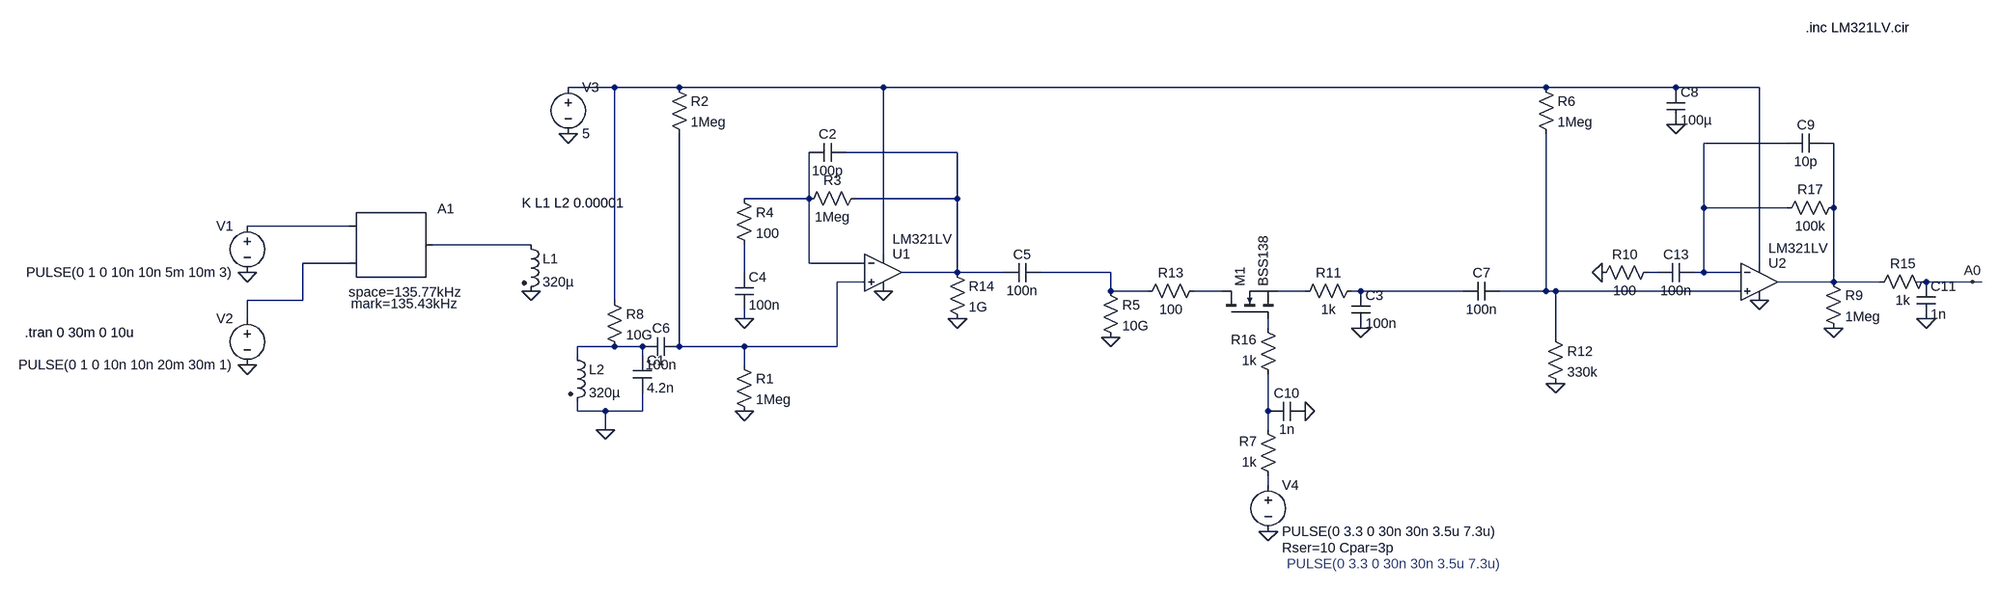
[diagram p0: schematic HGA22_LM321LV_V2.asc]
HGA22_LM321LV_V2.asc, the LTspice schematic file:
Version 4
SHEET 1 3324 728
WIRE 640 -112 560 -112
WIRE 752 -112 640 -112
WIRE 1104 -112 752 -112
WIRE 2272 -112 1104 -112
WIRE 2496 -112 2272 -112
WIRE 2640 -112 2496 -112
WIRE 2688 -16 2544 -16
WIRE 2768 -16 2752 -16
WIRE 1232 0 1040 0
WIRE 976 80 976 0
WIRE 976 80 864 80
WIRE 1232 80 1232 0
WIRE 1232 80 1056 80
WIRE 2544 96 2544 -16
WIRE 2688 96 2544 96
WIRE 2768 96 2768 -16
WIRE -48 128 -224 128
WIRE 496 160 96 160
WIRE 1104 176 1104 -112
WIRE -48 192 -128 192
WIRE 976 192 976 80
WIRE 1072 192 976 192
WIRE 2640 192 2640 -112
WIRE 864 208 864 160
WIRE 1232 208 1232 80
WIRE 1232 208 1136 208
WIRE 1312 208 1232 208
WIRE 1520 208 1376 208
WIRE 2464 208 2448 208
WIRE 2544 208 2544 96
WIRE 2544 208 2528 208
WIRE 2608 208 2544 208
WIRE 1072 224 1024 224
WIRE 2768 224 2768 96
WIRE 2768 224 2672 224
WIRE 2848 224 2768 224
WIRE 2928 224 2912 224
WIRE 3008 224 2928 224
WIRE 3024 224 3008 224
WIRE 1520 240 1520 208
WIRE 1584 240 1520 240
WIRE 1712 240 1664 240
WIRE 1856 240 1808 240
WIRE 1952 240 1936 240
WIRE 2128 240 1952 240
WIRE 2272 240 2272 -32
WIRE 2272 240 2192 240
WIRE 2288 240 2272 240
WIRE 2608 240 2288 240
WIRE -128 256 -128 192
WIRE -128 256 -224 256
WIRE 640 256 640 -112
WIRE -224 288 -224 256
WIRE 864 288 864 272
WIRE 1792 304 1792 288
WIRE 2288 320 2288 240
WIRE 640 336 576 336
WIRE 688 336 640 336
WIRE 752 336 752 -32
WIRE 864 336 752 336
WIRE 1024 336 1024 224
WIRE 1024 336 864 336
WIRE 576 352 576 336
WIRE 688 352 688 336
WIRE 864 368 864 336
WIRE 576 448 576 432
WIRE 624 448 576 448
WIRE 688 448 688 416
WIRE 688 448 624 448
WIRE 1792 448 1792 384
WIRE 624 480 624 448
WIRE 1792 480 1792 448
WIRE 1792 576 1792 560
FLAG -224 208 0
FLAG -224 368 0
FLAG 496 240 0
FLAG 560 -32 0
FLAG 1792 656 0
FLAG 864 448 0
FLAG 1104 240 0
FLAG 624 480 0
FLAG 2496 -48 0
FLAG 864 288 0
FLAG 2640 256 0
FLAG 1856 448 0
FLAG 1232 288 0
FLAG 2368 208 0
FLAG 1520 320 0
FLAG 2288 400 0
FLAG 1952 304 0
FLAG 2768 304 0
FLAG 2928 288 0
FLAG 3008 224 A0
SYMBOL SpecialFunctions\\modulate -48 128 R0
WINDOW 3 3 134 Left 2
WINDOW 123 -1 114 Left 2
SYMATTR Value mark=135.43kHz
SYMATTR Value2 space=135.77kHz
SYMATTR InstName A1
SYMBOL ind2 560 336 R0
SYMATTR InstName L2
SYMATTR Value 320µ
SYMATTR Type ind
SYMATTR SpiceLine Rser=0.1
SYMBOL cap 672 352 R0
SYMATTR InstName C1
SYMATTR Value 4.2n
SYMBOL voltage -224 112 M0
WINDOW 123 0 0 Left 0
WINDOW 39 0 0 Left 0
SYMATTR InstName V1
SYMATTR Value PULSE(0 1 0 10n 10n 5m 10m 3)
SYMBOL voltage -224 272 M0
WINDOW 123 0 0 Left 0
WINDOW 39 0 0 Left 0
SYMATTR InstName V2
SYMATTR Value PULSE(0 1 0 10n 10n 20m 30m 1)
SYMBOL ind2 480 144 R0
SYMATTR InstName L1
SYMATTR Value 320µ
SYMATTR Type ind
SYMBOL voltage 560 -128 R0
WINDOW 123 0 0 Left 0
WINDOW 39 24 44 Left 2
SYMATTR InstName V3
SYMATTR Value 5
SYMBOL voltage 1792 560 R0
WINDOW 123 0 0 Left 0
WINDOW 39 24 124 Left 2
SYMATTR SpiceLine Rser=10 Cpar=3p
SYMATTR InstName V4
SYMATTR Value PULSE(0 3.3 0 30n 30n 3.5u 7.3u)
SYMBOL res 848 352 R0
SYMATTR InstName R1
SYMATTR Value 1Meg
SYMBOL res 736 -128 R0
SYMATTR InstName R2
SYMATTR Value 1Meg
SYMBOL res 1072 64 R90
WINDOW 0 0 56 VBottom 2
WINDOW 3 32 56 VTop 2
SYMATTR InstName R3
SYMATTR Value 1Meg
SYMBOL cap 1040 -16 R90
WINDOW 0 0 32 VBottom 2
WINDOW 3 32 32 VTop 2
SYMATTR InstName C2
SYMATTR Value 100p
SYMBOL res 848 64 R0
SYMATTR InstName R4
SYMATTR Value 100
SYMBOL cap 752 320 R90
WINDOW 0 0 32 VBottom 2
WINDOW 3 32 32 VTop 2
SYMATTR InstName C6
SYMATTR Value 100n
SYMBOL Opamps\\opamp2 1104 144 R0
WINDOW 3 16 6 Left 2
SYMATTR Value LM321LV
SYMATTR InstName U1
SYMBOL cap 2480 -112 R0
SYMATTR InstName C8
SYMATTR Value 100µ
SYMBOL res 624 240 R0
SYMATTR InstName R8
SYMATTR Value 10G
SYMBOL Opamps\\opamp2 2640 160 R0
WINDOW 3 16 6 Left 2
SYMATTR Value LM321LV
SYMATTR InstName U2
SYMBOL res 1808 576 R180
WINDOW 0 36 76 Left 2
WINDOW 3 36 40 Left 2
SYMATTR InstName R7
SYMATTR Value 1k
SYMBOL cap 848 208 R0
SYMATTR InstName C4
SYMATTR Value 100n
SYMBOL cap 1856 432 R90
WINDOW 0 0 32 VBottom 2
WINDOW 3 32 32 VTop 2
SYMATTR InstName C10
SYMATTR Value 1n
SYMBOL res 1808 400 R180
WINDOW 0 36 76 Left 2
WINDOW 3 36 40 Left 2
SYMATTR InstName R16
SYMATTR Value 1k
SYMBOL res 1216 192 R0
SYMATTR InstName R14
SYMATTR Value 1G
SYMBOL res 2784 80 R90
WINDOW 0 0 56 VBottom 2
WINDOW 3 32 56 VTop 2
SYMATTR InstName R17
SYMATTR Value 100k
SYMBOL res 2464 192 R90
WINDOW 0 0 56 VBottom 2
WINDOW 3 32 56 VTop 2
SYMATTR InstName R10
SYMATTR Value 100
SYMBOL cap 2528 192 R90
WINDOW 0 0 32 VBottom 2
WINDOW 3 32 32 VTop 2
SYMATTR InstName C13
SYMATTR Value 100n
SYMBOL nmos 1712 288 R270
SYMATTR InstName M1
SYMATTR Value BSS138
SYMBOL res 1504 224 R0
SYMATTR InstName R5
SYMATTR Value 10G
SYMBOL res 2256 -128 R0
SYMATTR InstName R6
SYMATTR Value 1Meg
SYMBOL res 2272 304 R0
SYMATTR InstName R12
SYMATTR Value 330k
SYMBOL res 1680 224 R90
WINDOW 0 0 56 VBottom 2
WINDOW 3 32 56 VTop 2
SYMATTR InstName R13
SYMATTR Value 100
SYMBOL cap 2752 -32 R90
WINDOW 0 0 32 VBottom 2
WINDOW 3 32 32 VTop 2
SYMATTR InstName C9
SYMATTR Value 10p
SYMBOL cap 1936 240 R0
SYMATTR InstName C3
SYMATTR Value 100n
SYMBOL res 1952 224 R90
WINDOW 0 0 56 VBottom 2
WINDOW 3 32 56 VTop 2
SYMATTR InstName R11
SYMATTR Value 1k
SYMBOL cap 1376 192 R90
WINDOW 0 0 32 VBottom 2
WINDOW 3 32 32 VTop 2
SYMATTR InstName C5
SYMATTR Value 100n
SYMBOL cap 2192 224 R90
WINDOW 0 0 32 VBottom 2
WINDOW 3 32 32 VTop 2
SYMATTR InstName C7
SYMATTR Value 100n
SYMBOL res 2752 208 R0
SYMATTR InstName R9
SYMATTR Value 1Meg
SYMBOL res 2944 208 R90
WINDOW 0 0 56 VBottom 2
WINDOW 3 32 56 VTop 2
SYMATTR InstName R15
SYMATTR Value 1k
SYMBOL cap 2912 224 R0
SYMATTR InstName C11
SYMATTR Value 1n
TEXT -608 312 Left 2 !.tran 0 30m 0 10u
TEXT 480 88 Left 2 !K L1 L2 0.00001
TEXT 2720 -216 Left 2 !.inc LM321LV.cir
TEXT 1824 712 Left 2 ;PULSE(0 3.3 0 30n 30n 3.5u 7.3u)

The netlist it stands for:
* HGA22_LM321LV_V2.asc
A1 N006 N008 0 0 0 0 N007 0 MODULATOR mark=135.43kHz space=135.77kHz
L2 N018 0 320µ Rser=0.1
C1 N018 0 4.2n
V1 N006 0 PULSE(0 1 0 10n 10n 5m 10m 3)
V2 N008 0 PULSE(0 1 0 10n 10n 20m 30m 1)
L1 N007 0 320µ
V3 N001 0 5
V4 N020 0 PULSE(0 3.3 0 30n 30n 3.5u 7.3u) Rser=10 Cpar=3p
R1 N012 0 1Meg
R2 N001 N012 1Meg
R3 N004 N005 1Meg
C2 N004 N005 100p
R4 N005 N009 100
C6 N012 N018 100n
XU1 N012 N005 N001 0 N004 LM321LV  ; pins In+ In- V+ V- OUT
C8 N001 0 100µ
R8 N001 N018 10G
XU2 N016 N002 N001 0 N003 LM321LV  ; pins In+ In- V+ V- OUT
R7 N020 N019 1k
C4 N009 0 100n
C10 0 N019 1n
R16 N019 N017 1k
R14 N004 0 1G
R17 N003 N002 100k
R10 N011 0 100
C13 N002 N011 100n
M1 N013 N017 N014 N014 BSS138
R5 N010 0 10G
R6 N001 N016 1Meg
R12 N016 0 330k
R13 N013 N010 100
C9 N003 N002 10p
C3 N015 0 100n
R11 N015 N014 1k
C5 N010 N004 100n
C7 N016 N015 100n
R9 N003 0 1Meg
R15 A0 N003 1k
C11 A0 0 1n
.model NMOS NMOS
.model PMOS PMOS
.lib standard.mos
.tran 0 30m 0 10u
K L1 L2 0.00001
.inc LM321LV.cir
* PULSE(0 3.3 0 30n 30n 3.5u 7.3u)
.backanno
.end